# Altium project main_Project.PrjPcb
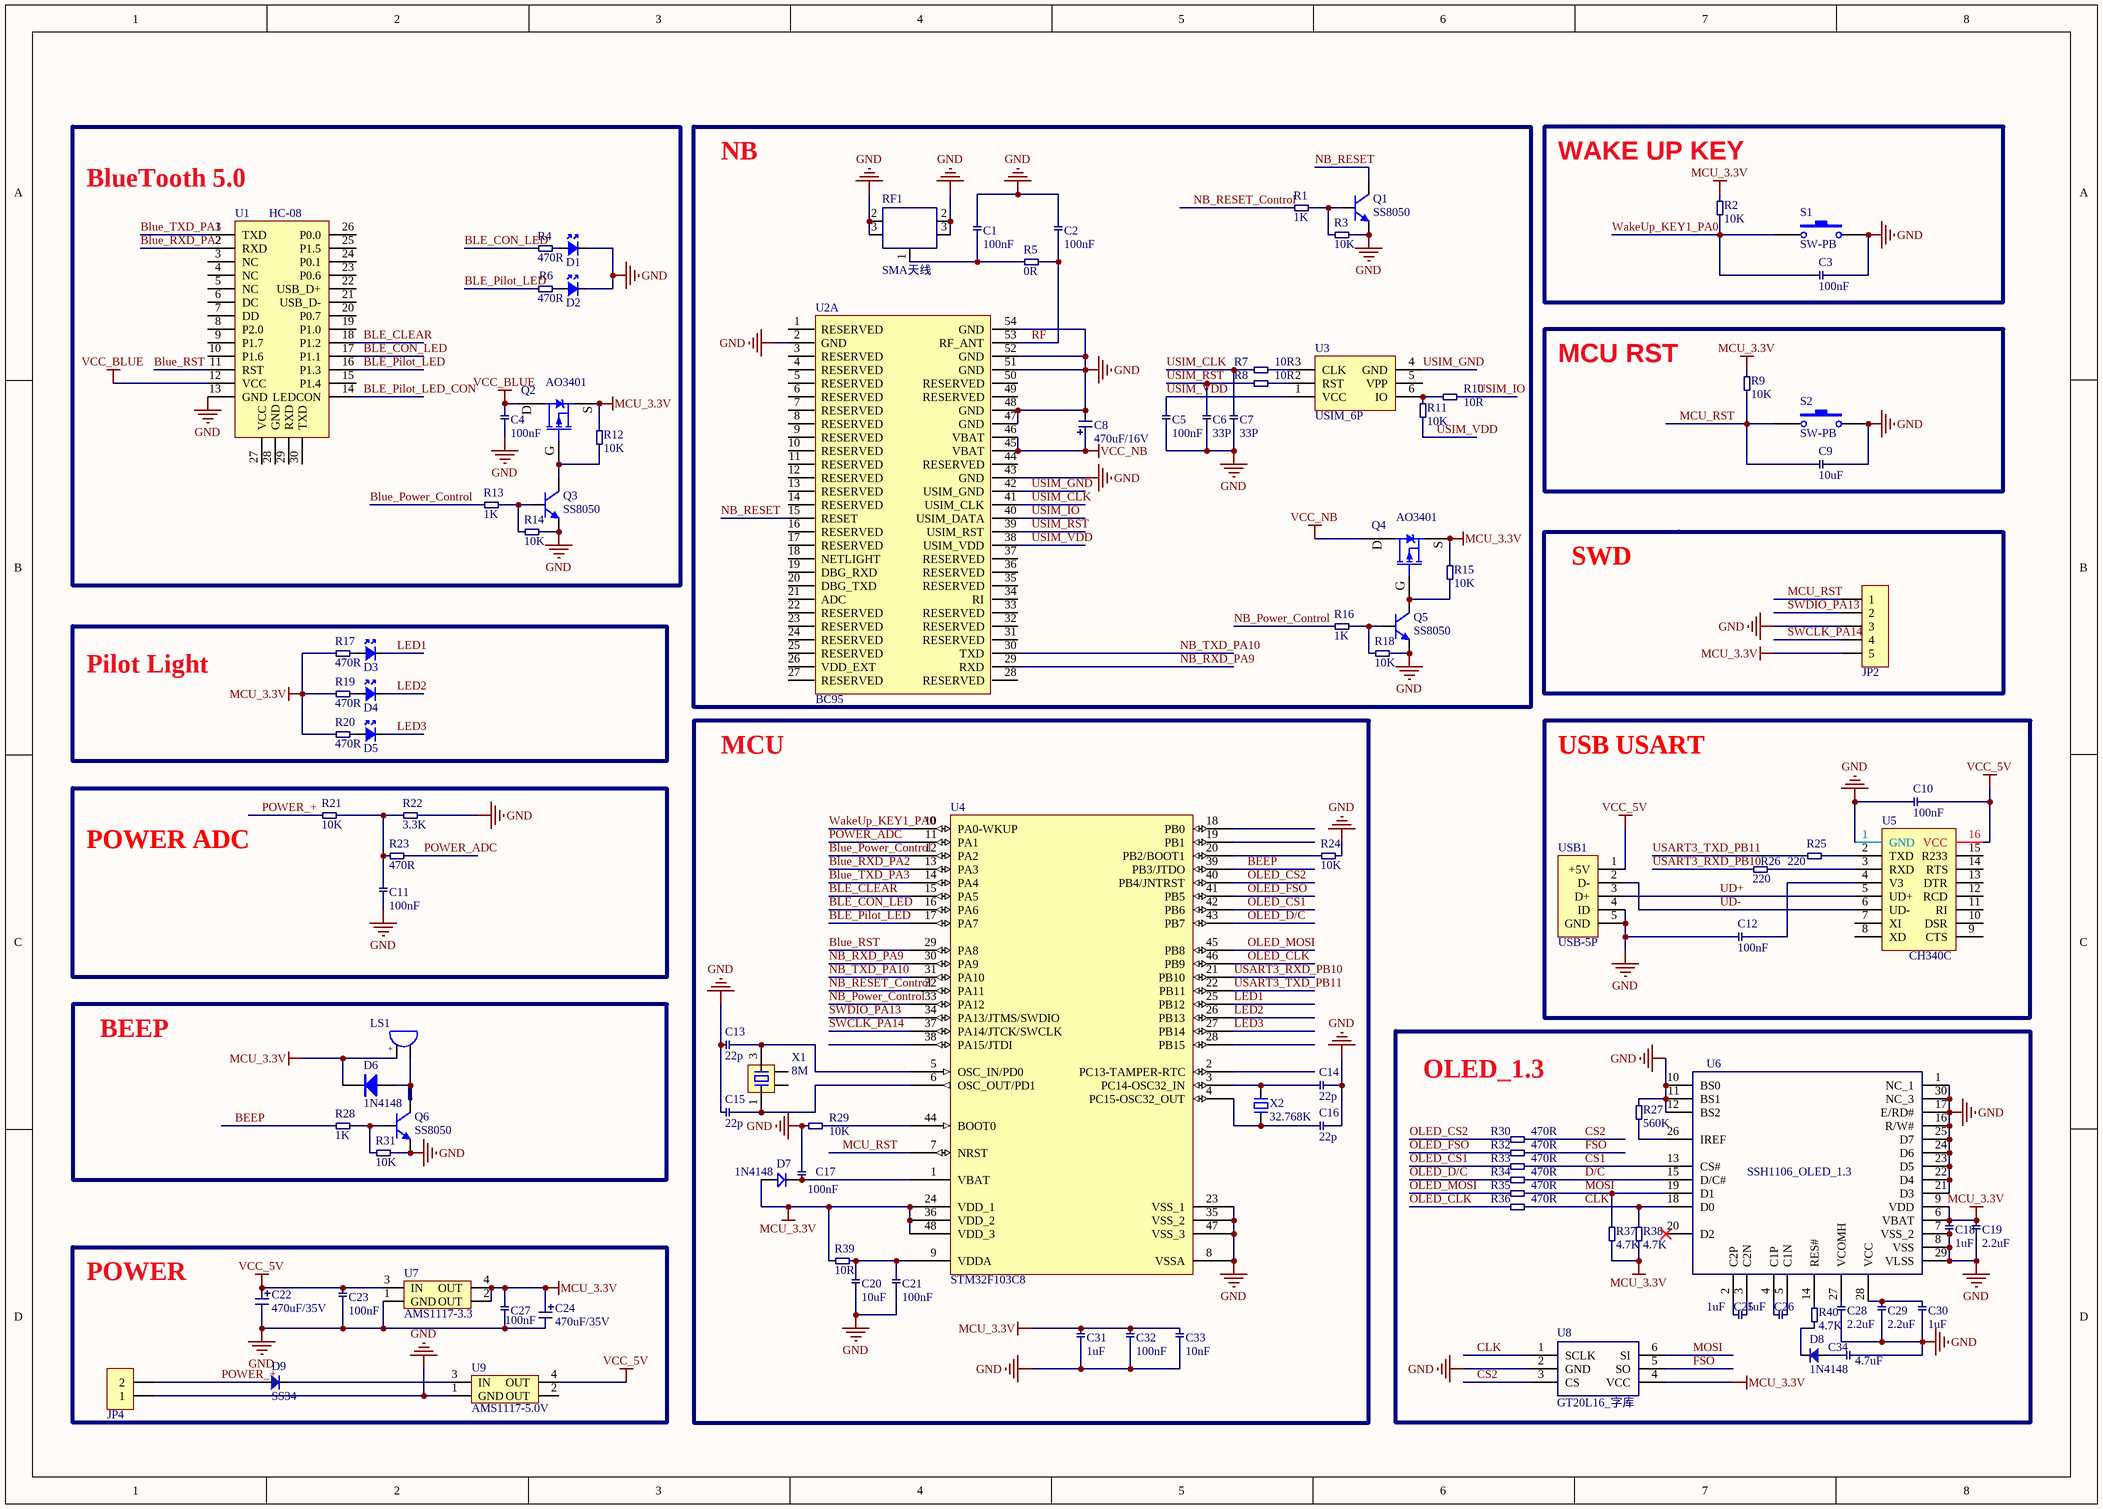
[diagram p0: Data_Blue.SchDoc]
1 sheet, 107 parts. Net scope: global (net labels, ports and power ports of the same name join across sheets).
Board files: BC95_BLUE.PcbDoc, BC95_BLUE拼板.PcbDoc

## Sheet Data_Blue.SchDoc
size A3; Organization: Altium Limited; Address1: L3, 12a Rodborough Rd; Address2: Frenchs Forest; Address3: NSW; Address4: Australia 2086

### Parts
C1  100nF  [0603CC]
C2  100nF  [0603CC]
C3  100nF  [0603CC]
C4  100nF  [0603CC]
C5  100nF  [0603CC]
C6  33P  [0603CC]
C7  33P  [0603CC]
C8  470uF/16V  [C3216]
C9  10uF  [0603CC]
C10  100nF  [0603CC]
C11  100nF  [0603CC]
C12  100nF  [0603CC]
C13  22p  [0603CC]
C14  22p  [0603CC]
C15  22p  [0603CC]
C16  22p  [0603CC]
C17  100nF  [0603CC]
C18  1uF  [0603CC]
C19  2.2uF  [0603CC]
C20  10uF  [0603CC]
C21  100nF  [0603CC]
C22  470uF/35V  [CD A(3216)]
C23  100nF  [0603CC]
C24  470uF/35V  [C3216]
C25  1uF  [0603CC]
C26  1uF  [0603CC]
C27  100nF  [0603CC]
C28  2.2uF  [0603CC]
C29  2.2uF  [0603CC]
C30  1uF  [0603CC]
C31  1uF  [0603CC]
C32  100nF  [0603CC]
C33  10nF  [0603CC]
C34  4.7uF  [0603CC]
D1  LED  [LED 0603G]  (value not drawn)
D2  LED  [LED 0603R]  (value not drawn)
D3  LED  [LED 3MM-G]  (value not drawn)
D4  LED  [LED 3MM-G]  (value not drawn)
D5  LED  [LED 3MM-G]  (value not drawn)
D6  1N4148  [SOD-323]
D7  1N4148  [SOD-323]
D8  1N4148  [SOD-523]
D9  SS34  [SMA]
JP2  HDR-1X5  [HDR2.54-LI-5P]  (value not drawn)
JP4  HDR-1X2  [XH2.54-WI-2P]  (value not drawn)
LS1  DC5V  [BEEP 5x9x5.5]  (value not drawn)
Q1  SS8050  [SOT23-3N]
Q2  AO3401  [SOT23-3N]
Q3  SS8050  [SOT23-3N]
Q4  AO3401  [SOT23-3N]
Q5  SS8050  [SOT23-3N]
Q6  SS8050  [SOT23-3N]
R1  1K  [0603RR]
R2  10K  [0603RR]
R3  10K  [0603RR]
R4  470R  [0603RR]
R5  0R  [0603RR]
R6  470R  [0603RR]
R7  10R  [0603RR]
R8  10R  [0603RR]
R9  10K  [0603RR]
R10  10R  [0603RR]
R11  10K  [0603RR]
R12  10K  [0603RR]
R13  1K  [0603RR]
R14  10K  [0603RR]
R15  10K  [0603RR]
R16  1K  [0603RR]
R17  470R  [0603RR]
R18  10K  [0603RR]
R19  470R  [0603RR]
R20  470R  [0603RR]
R21  10K  [0603RR]
R22  3.3K  [0603RR]
R23  470R  [0603RR]
R24  10K  [0603RR]
R25  220  [0603RR]
R26  220  [0603RR]
R27  560K  [0603RR]
R28  1K  [0603RR]
R29  10K  [0603RR]
R30  470R  [0603RR]
R31  10K  [0603RR]
R32  470R  [0603RR]
R33  470R  [0603RR]
R34  470R  [0603RR]
R35  470R  [0603RR]
R36  470R  [0603RR]
R37  4.7K  [0603RR]
R38  4.7K  [0603RR]
R39  10R  [0603RR]
R40  4.7K  [0603RR]
RF1  SMA天线  [SMA_FR]
S1  SW-PB  [TSW SMD-6*6*6]
S2  SW-PB  [TSW SMD-4*4*1.5]
U1  HC-08  [HC-08]
U2  BC95  [BC95]  (part A of 2)
U3  USIM_6P  [SIM 6P 自弹]
U4  STM32F103C8  [LQFP48 7X7_M]
U5  CH340C  [SOP16_L]
U6  SSH1106_OLED_1.3  [OLED_1.3_FPC_30]
U7  AMS1117-3.3  [SOT223_N]
U8  GT20L16_字库  [SOT23-6]
U9  AMS1117-5.0V  [SOT223_N]
USB1  USB-5P  [USB-MICRO_A]
X1  8M  [OSC 3225-4P]
X2  32.768K  [OSC 3215-2P]

### Nets
GND: C1.2 C2.2 C3.2 C4.1 C5.1 C6.1 C7.1 C8.2 C9.1 C10.2 C11.1 C12.2 C13.1 C14.2 C15.1 C16.2 C17.2 C18.1 C19.1 C20.1 C21.1 C22.2 C23.1 C24.2 C27.1 C28.1 C29.1 C30.1 C31.1 C32.1 C33.1 C34.1 D1.2(CATHODE) D2.2(CATHODE) JP2.3 JP4.1 Q1.2(E) Q3.2(E) Q5.2(E) Q6.2(E) R3.2 R14.2 R18.2 R22.2 R24.2 R27.2 R29.1 R31.2 RF1.2 RF1.3 S1.2 S2.2 U1.13(GND) U2.2(GND) U2.43(GND) U2.47(GND) U2.48(GND) U2.51(GND) U2.52(GND) U2.54(GND) U4.8(VSSA) U4.23(VSS_1) U4.35(VSS_2) U4.47(VSS_3) U5.1(GND) U6.1(NC_1) U6.7(VSS_2) U6.8(VSS) U6.10(BS0) U6.11(BS1) U6.12(BS2) U6.16(R/W#) U6.17(E/RD#) U6.21(D3) U6.22(D4) U6.23(D5) U6.24(D6) U6.25(D7) U6.29(VLSS) U6.30(NC_3) U7.1(GND) U8.2(GND) U9.1(GND) USB1.4(ID) USB1.5(GND)
MCU_3.3V: C18.2 C19.2 C24.1 C27.2 C31.2 C32.2 C33.2 D6.2(K) D7.1 JP2.5 LS1.1 Q2.2(S) Q4.2(S) R2.2 R9.2 R12.2 R15.2 R17.1 R19.1 R20.1 R37.1 R38.1 R39.1 U4.24(VDD_1) U4.36(VDD_2) U4.48(VDD_3) U6.6(VBAT) U6.9(VDD) U7.2(OUT) U7.4(OUT) U8.4(VCC)
VCC_5V: C10.1 C22.1 C23.2 U5.16(VCC) U7.3(IN) U9.4(OUT) USB1.1(+5V)
VCC_BLUE: C4.2 Q2.3(D) U1.12(VCC)
VCC_NB: C8.1 Q4.3(D) U2.45(VBAT) U2.46(VBAT)
BEEP: R28.1 U4.39(PB3/JTDO)
BLE_CLEAR: U1.18(P1.2) U4.15(PA5)
BLE_CON_LED: R4.1 U1.17(P1.1) U4.16(PA6)
BLE_Pilot_LED: R6.1 U1.16(P1.3) U4.17(PA7)
BLE_Pilot_LED_CON: U1.14(LEDCON)
Blue_Power_Control: R13.1 U4.12(PA2)
Blue_RST: U1.11(RST) U4.29(PA8)
Blue_RXD_PA2: U1.2(RXD) U4.13(PA3)
Blue_TXD_PA3: U1.1(TXD) U4.14(PA4)
CLK: R36.2 R38.2 U6.18(D0) U8.1(SCLK)
CS1: R33.2 U6.13(CS#)
CS2: R30.2 U8.3(CS)
D/C: R34.2 U6.15(D/C#)
FSO: R32.2 U8.5(SO)
LED1: D3.2(CATHODE) U4.25(PB12)
LED2: D4.2(CATHODE) U4.26(PB13)
LED3: D5.2(CATHODE) U4.27(PB14)
MCU_RST: C9.2 JP2.1 R9.1 S2.1 U4.7(NRST)
MOSI: R35.2 R37.2 U6.19(D1) U8.6(SI)
NB_Power_Control: R16.1 U4.33(PA12)
NB_RESET: Q1.3(C) U2.15(RESET)
NB_RESET_Control: R1.1 U4.32(PA11)
NB_RXD_PA9: U2.29(RXD) U4.30(PA9)
NB_TXD_PA10: U2.30(TXD) U4.31(PA10)
OLED_CLK: R36.1 U4.46(PB9)
OLED_CS1: R33.1 U4.42(PB6)
OLED_CS2: R30.1 U4.40(PB4/JNTRST)
OLED_D/C: R34.1 U4.43(PB7)
OLED_FSO: R32.1 U4.41(PB5)
OLED_MOSI: R35.1 U4.45(PB8)
POWER_+: D9.1(ANODE) JP4.2 R21.1
POWER_ADC: R23.1 U4.11(PA1)
RF: C2.1 R5.1 U2.53(RF_ANT)
SWCLK_PA14: JP2.4 U4.37(PA14/JTCK/SWCLK)
SWDIO_PA13: JP2.2 U4.34(PA13/JTMS/SWDIO)
UD+: U5.5(UD+) USB1.3(D+)
UD-: U5.6(UD-) USB1.2(D-)
USART3_RXD_PB10: R26.1 U4.21(PB10)
USART3_TXD_PB11: R25.1 U4.22(PB11)
USIM_CLK: C7.2 R7.1 U2.41(USIM_CLK)
USIM_GND: U2.42(USIM_GND) U3.4(GND)
USIM_IO: R10.1 U2.40(USIM_DATA)
USIM_RST: C6.2 R8.1 U2.39(USIM_RST)
USIM_VDD: C5.2 R11.1 U2.38(USIM_VDD) U3.1(VCC)
WakeUp_KEY1_PA0: C3.1 R2.1 S1.1 U4.10(PA0-WKUP)
NetC1_1: C1.1 R5.2 RF1.1
NetC11_2: C11.2 R21.2 R22.1 R23.2
NetC12_1: C12.1 U5.4(V3)
NetC13_2: C13.2 U4.5(OSC_IN/PD0) X1.3
NetC14_1: C14.1 U4.3(PC14-OSC32_IN) X2.2
NetC15_2: C15.2 U4.6(OSC_OUT/PD1) X1.1
NetC16_1: C16.1 U4.4(PC15-OSC32_OUT) X2.1
NetC17_1: C17.1 D7.2 U4.1(VBAT)
NetC20_2: C20.2 C21.2 R39.2 U4.9(VDDA)
NetC25_1: C25.1 U6.2(C2P)
NetC25_2: C25.2 U6.3(C2N)
NetC26_1: C26.1 U6.4(C1P)
NetC26_2: C26.2 U6.5(C1N)
NetC28_2: C28.2 U6.27(VCOMH)
NetC29_2: C29.2 C30.2 U6.28(VCC)
NetC34_2: C34.2 D8.1(ANODE)
NetD1_1: D1.1(ANODE) R4.2
NetD2_1: D2.1(ANODE) R6.2
NetD3_1: D3.1(ANODE) R17.2
NetD4_1: D4.1(ANODE) R19.2
NetD5_1: D5.1(ANODE) R20.2
NetD6_1: D6.1(A) LS1.2 Q6.3(C)
NetD8_2: D8.2(CATHODE) R40.2
NetD9_2: D9.2(CATHODE) U9.3(IN)
NetQ1_1: Q1.1(B) R1.2 R3.1
NetQ2_1: Q2.1(G) Q3.3(C) R12.1
NetQ3_1: Q3.1(B) R13.2 R14.1
NetQ4_1: Q4.1(G) Q5.3(C) R15.1
NetQ5_1: Q5.1(B) R16.2 R18.1
NetQ6_1: Q6.1(B) R28.2 R31.1
NetR7_2: R7.2 U3.3(CLK)
NetR8_2: R8.2 U3.2(RST)
NetR10_2: R10.2 R11.2 U3.6(IO)
NetR24_1: R24.1 U4.20(PB2/BOOT1)
NetR25_2: R25.2 U5.2(TXD)
NetR26_2: R26.2 U5.3(RXD)
NetR27_1: R27.1 U6.26(IREF)
NetR29_2: R29.2 U4.44(BOOT0)
NetR40_1: R40.1 U6.14(RES#)

Not connected (* = marked no-connect by the designer): U1 3(NC) 4(NC) 5(NC) 6(DC) 7(DD) 8(P2.0) 9(P1.7) 10(P1.6) 15(P1.4) 19(P1.0) 20(P0.7) 21(USB_D-) 22(USB_D+) 23(P0.6) 24(P0.1) 25(P1.5) 26(P0.0) 27(VCC) 28(GND) 29(RXD) 30(TXD); U2 1(RESERVED) 3(RESERVED) 4(RESERVED) 5(RESERVED) 6(RESERVED) 7(RESERVED) 8(RESERVED) 9(RESERVED) 10(RESERVED) 11(RESERVED) 12(RESERVED) 13(RESERVED) 14(RESERVED) 16(RESERVED) 17(RESERVED) 18(NETLIGHT) 19(DBG_RXD) 20(DBG_TXD) 21(ADC) 22(RESERVED) 23(RESERVED) 24(RESERVED) 25(RESERVED) 26(VDD_EXT) 27(RESERVED) 28(RESERVED) 31(RESERVED) 32(RESERVED) 33(RESERVED) 34(RI) 35(RESERVED) 36(RESERVED) 37(RESERVED) 44(RESERVED) 49(RESERVED) 50(RESERVED); U3 5(VPP); U4 2(PC13-TAMPER-RTC) 18(PB0) 19(PB1) 28(PB15) 38(PA15/JTDI); U5 7(XI) 8(XD) 9(CTS) 10(DSR) 11(RI) 12(RCD) 13(DTR) 14(RTS) 15(R233); U6 20(D2)*; U9 2(OUT); X1 2 4

### Notes on the sheet
- NB
- (near R2) WAKE UP KEY
- (near U1) BlueTooth 5.0
- MCU RST
- SWD
- Pilot Light
- MCU
- USB USART
- POWER ADC
- BEEP
- OLED_1.3
- POWER
- Title
- Size:
- Date:
- A3
- Number:
- Time:
- Revision:
- Sheet
- of
- File:
- (in symbol BEEP) +

### Library data of the parts
C1-C7 C9-C21 C23 C25-C34 = cap
C8 C22 C24 = Ecap
D6 = 1N4148: 高速开关二极管; 版权归属: 源创客; BOM名称: 高速开关二极管; 学习资源: www.ooocke.com
D7 = D
D8 D9 = Diod
JP2 = Header 5: 5P接插件; 版权归属: 源创客; BOM名称: 5P接插件; 学习资源: www.ooocke.com
JP4 = Header 2: 2P接插件; 版权归属: 源创客; BOM名称: 2P接插件; 学习资源: www.ooocke.com
LS1 = BEEP: 蜂鸣器; 版权归属: 源创客; BOM名称: 蜂鸣器; 学习资源: www.ooocke.com
Q1 Q3 Q5 Q6 = 8050-SMD: 高频放大-NPN型; 版权归属: 源创客; 属性: 40V 1.5A 1W 100MHZ; BOM名称: 高频放大-NPN型; 学习资源: www.ooocke.com
Q2 Q4 = SI2301: P沟道场效应管; 版权归属: 源创客; BOM名称: P沟道场效应管; 学习资源: www.ooocke.com
R1-R40 = res
S1 S2 = SW-PB: Switch; Published: 24-Mar-1999; LatestRevisionDate: 17-Jul-2002; LatestRevisionNote: Re-released for DXP Platform.; PackageReference: SPST-2; Publisher: Altium Limited
U3 = USIM-6P
U4 = STM32F103C8: Flaah:64/RAM:20/IO:36; BOM名称: 32位STM单片机; 版权归属: 源创客; 学习资源: www.ooocke.com
U7 U9 = AMS1117
USB1 = USB-5P: 微型USB母座; 版权归属: 源创客; BOM名称: 微型USB母座; 学习资源: www.ooocke.com
X1 = XTAL-4P: 4脚无源晶振; 版权归属: 源创客; BOM名称: 4脚无源晶振; 学习资源: www.ooocke.com
X2 = XTAL-2P: 2脚无源脚晶振; 版权归属: 源创客; BOM名称: 2脚无源脚晶振; 学习资源: www.ooocke.com
U2 = BC95: Value: *; Part Description: *; Height: *; Manufacture: *